# Altium schematic sheet MPU6050.SchDoc: MPU6050
size A4; DrawnBy: Huseyin; Organization: Altium Limited; Address1: L3, 12a Rodborough Rd; Address2: Frenchs Forest; Address3: NSW; Address4: Australia 2086; Revision: 1; SheetNumber: 2; SheetTotal: 3
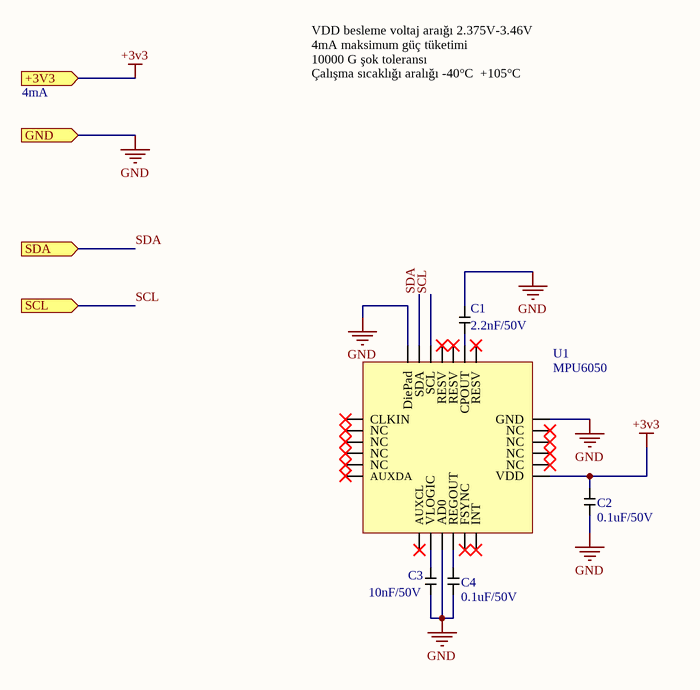
[diagram p0: MPU6050.SchDoc]

## Parts
C1  2.2nF/50V
C2  0.1uF/50V  [Cap_0805]
C3  10nF/50V  [Cap_0805]
C4  0.1uF/50V  [Cap_0805]
U1  MPU6050  [QFN24]

## Ports
+3V3 (in), GND (in), SCL (in), SDA (in)

## Nets
+3v3: C2.1 U1.13(VDD) ; port +3V3
GND: C1.1 C2.2 C3.1 C4.2 U1.9(AD0) U1.18(GND) U1.25(DiePad) ; port GND
SCL: U1.23(SCL) ; port SCL
SDA: U1.24(SDA) ; port SDA
NetC1_1: C1.1 U1.20(CPOUT)
NetC3_2: C3.2 U1.8(VLOGIC)
NetC4_1: C4.1 U1.10(REGOUT)

Not connected (* = marked no-connect by the designer): U1 1(CLKIN)* 2(NC)* 3(NC)* 4(NC)* 5(NC)* 6(AUXDA)* 7(AUXCL)* 11(FSYNC)* 12(INT)* 14(NC)* 15(NC)* 16(NC)* 17(NC)* 19(RESV)* 21(RESV)* 22(RESV)*

## Notes on the sheet
- VDD besleme voltaj araığı 2.375V-3.46V
  4mA maksimum güç tüketimi
  10000 G şok toleransı
  Çalışma sıcaklığı aralığı -40°C  +105°C
- 4mA
- Size:
- Title
- A4
- DrawnBy
- Revision:
- YBU
- Batı Kampüsü
- Etlik Keçiören
- Date:
- Time:
- Sheet
- of
- Ankara / Türkiye

## Library data of the parts
C1 = CL21B222KBANNNC: MLCC (2012) 0805 2.2nF 50VDC ±10% X7R
C2 C4 = CL21B104JBCNNNC: MLCC (2012) 0805 100nF 50VDC ±5% X7R
C3 = CL21B103KBANNNC: MLCC (2012) 0805 10nF 50VDC ±10% X7R
U1 = MPU-6050: IC-6050 SENSOR MOTION QFN24